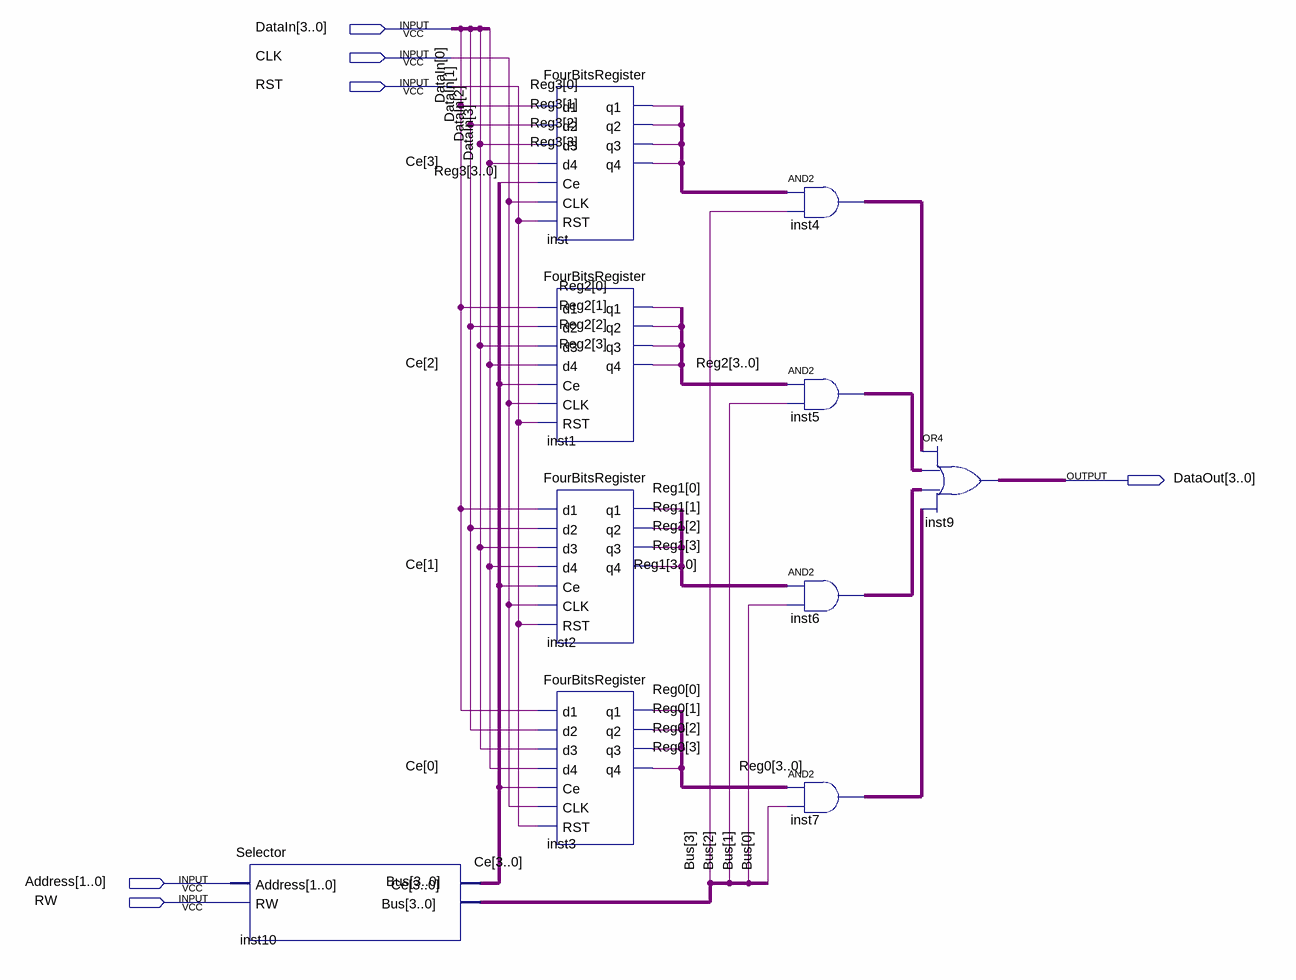
[diagram p0: schematic sheet]
// Quartus schematic FourFourBitSRAM.bdf as structural Verilog: 10 symbols, 6 pins
module FourFourBitSRAM (
  input  [3:0] DataIn,
  input  CLK,
  input  RST,
  input  [1:0] Address,
  input  RW,
  output [3:0] DataOut
);

  wire [3:0] Bus, Ce, inst4_out, inst5_out, inst6_out, inst7_out, Reg0, Reg1, Reg2, Reg3;

  Selector inst10 (.Address(Address), .RW(RW), .Ce(Ce), .Bus(Bus));
  FourBitsRegister inst (
    .d1(DataIn[0]), .d2(DataIn[1]), .d3(DataIn[2]), .d4(DataIn[3]), .Ce(Ce[3]), .CLK(CLK), .RST(RST),
    .q1(Reg3[0]), .q2(Reg3[1]), .q3(Reg3[2]), .q4(Reg3[3]));
  FourBitsRegister inst1 (
    .d1(DataIn[0]), .d2(DataIn[1]), .d3(DataIn[2]), .d4(DataIn[3]), .Ce(Ce[2]), .CLK(CLK), .RST(RST),
    .q1(Reg2[0]), .q2(Reg2[1]), .q3(Reg2[2]), .q4(Reg2[3]));
  FourBitsRegister inst2 (
    .d1(DataIn[0]), .d2(DataIn[1]), .d3(DataIn[2]), .d4(DataIn[3]), .Ce(Ce[1]), .CLK(CLK), .RST(RST),
    .q1(Reg1[0]), .q2(Reg1[1]), .q3(Reg1[2]), .q4(Reg1[3]));
  FourBitsRegister inst3 (
    .d1(DataIn[0]), .d2(DataIn[1]), .d3(DataIn[2]), .d4(DataIn[3]), .Ce(Ce[0]), .CLK(CLK), .RST(RST),
    .q1(Reg0[0]), .q2(Reg0[1]), .q3(Reg0[2]), .q4(Reg0[3]));
  assign inst4_out = Reg3 & {4{Bus[3]}};  // AND2 inst4, 4 bits wide
  assign inst5_out = Reg2 & {4{Bus[2]}};  // AND2 inst5, 4 bits wide
  assign inst6_out = Reg1 & {4{Bus[1]}};  // AND2 inst6, 4 bits wide
  assign inst7_out = Reg0 & {4{Bus[0]}};  // AND2 inst7, 4 bits wide
  assign DataOut = inst4_out | inst5_out | inst6_out | inst7_out;  // OR4 inst9, 4 bits wide
endmodule
